# Altium project Daughter_Board_IF_RX.PrjPcb (part 2 of 2)

## Sheet Power.SchDoc: {Наименование}
size 420 x 297 mm; ApprovedBy: {Утвердил}; CheckedBy: {Проверил}; DrawnBy: {Разраб.}; DocumentNumber: НРДЦ.ХХХХХХ.ХХХ 00; SheetNumber: {}; SheetTotal: {}; Scale: {Мш.}; PageSetup: Record=PageOptions|CenterHorizontal=False|CenterVertical=False|PrintScale=0.95|XCorrection=0.00|YCorrection=0.00|PrintKind=1|BorderSize=5000000|LeftOffset=0|BottomOffset=0|Orientation=1|PaperLength=1000|PaperWidth=1000|Scale=100|PaperSource=15|PrintQuality=600|MediaType=1|DitherType=10|PaperKind=A4|PrintScaleMode=1; ProcessInspection: {Т.контр.}; Mass: {М.}; NormInspection: {Н.контр.}; Letter1Column: {}; Letter2Column: {}; Letter3Column: {}; DocumentType: {Документ}; Rule: PcbType=ProtelPcb
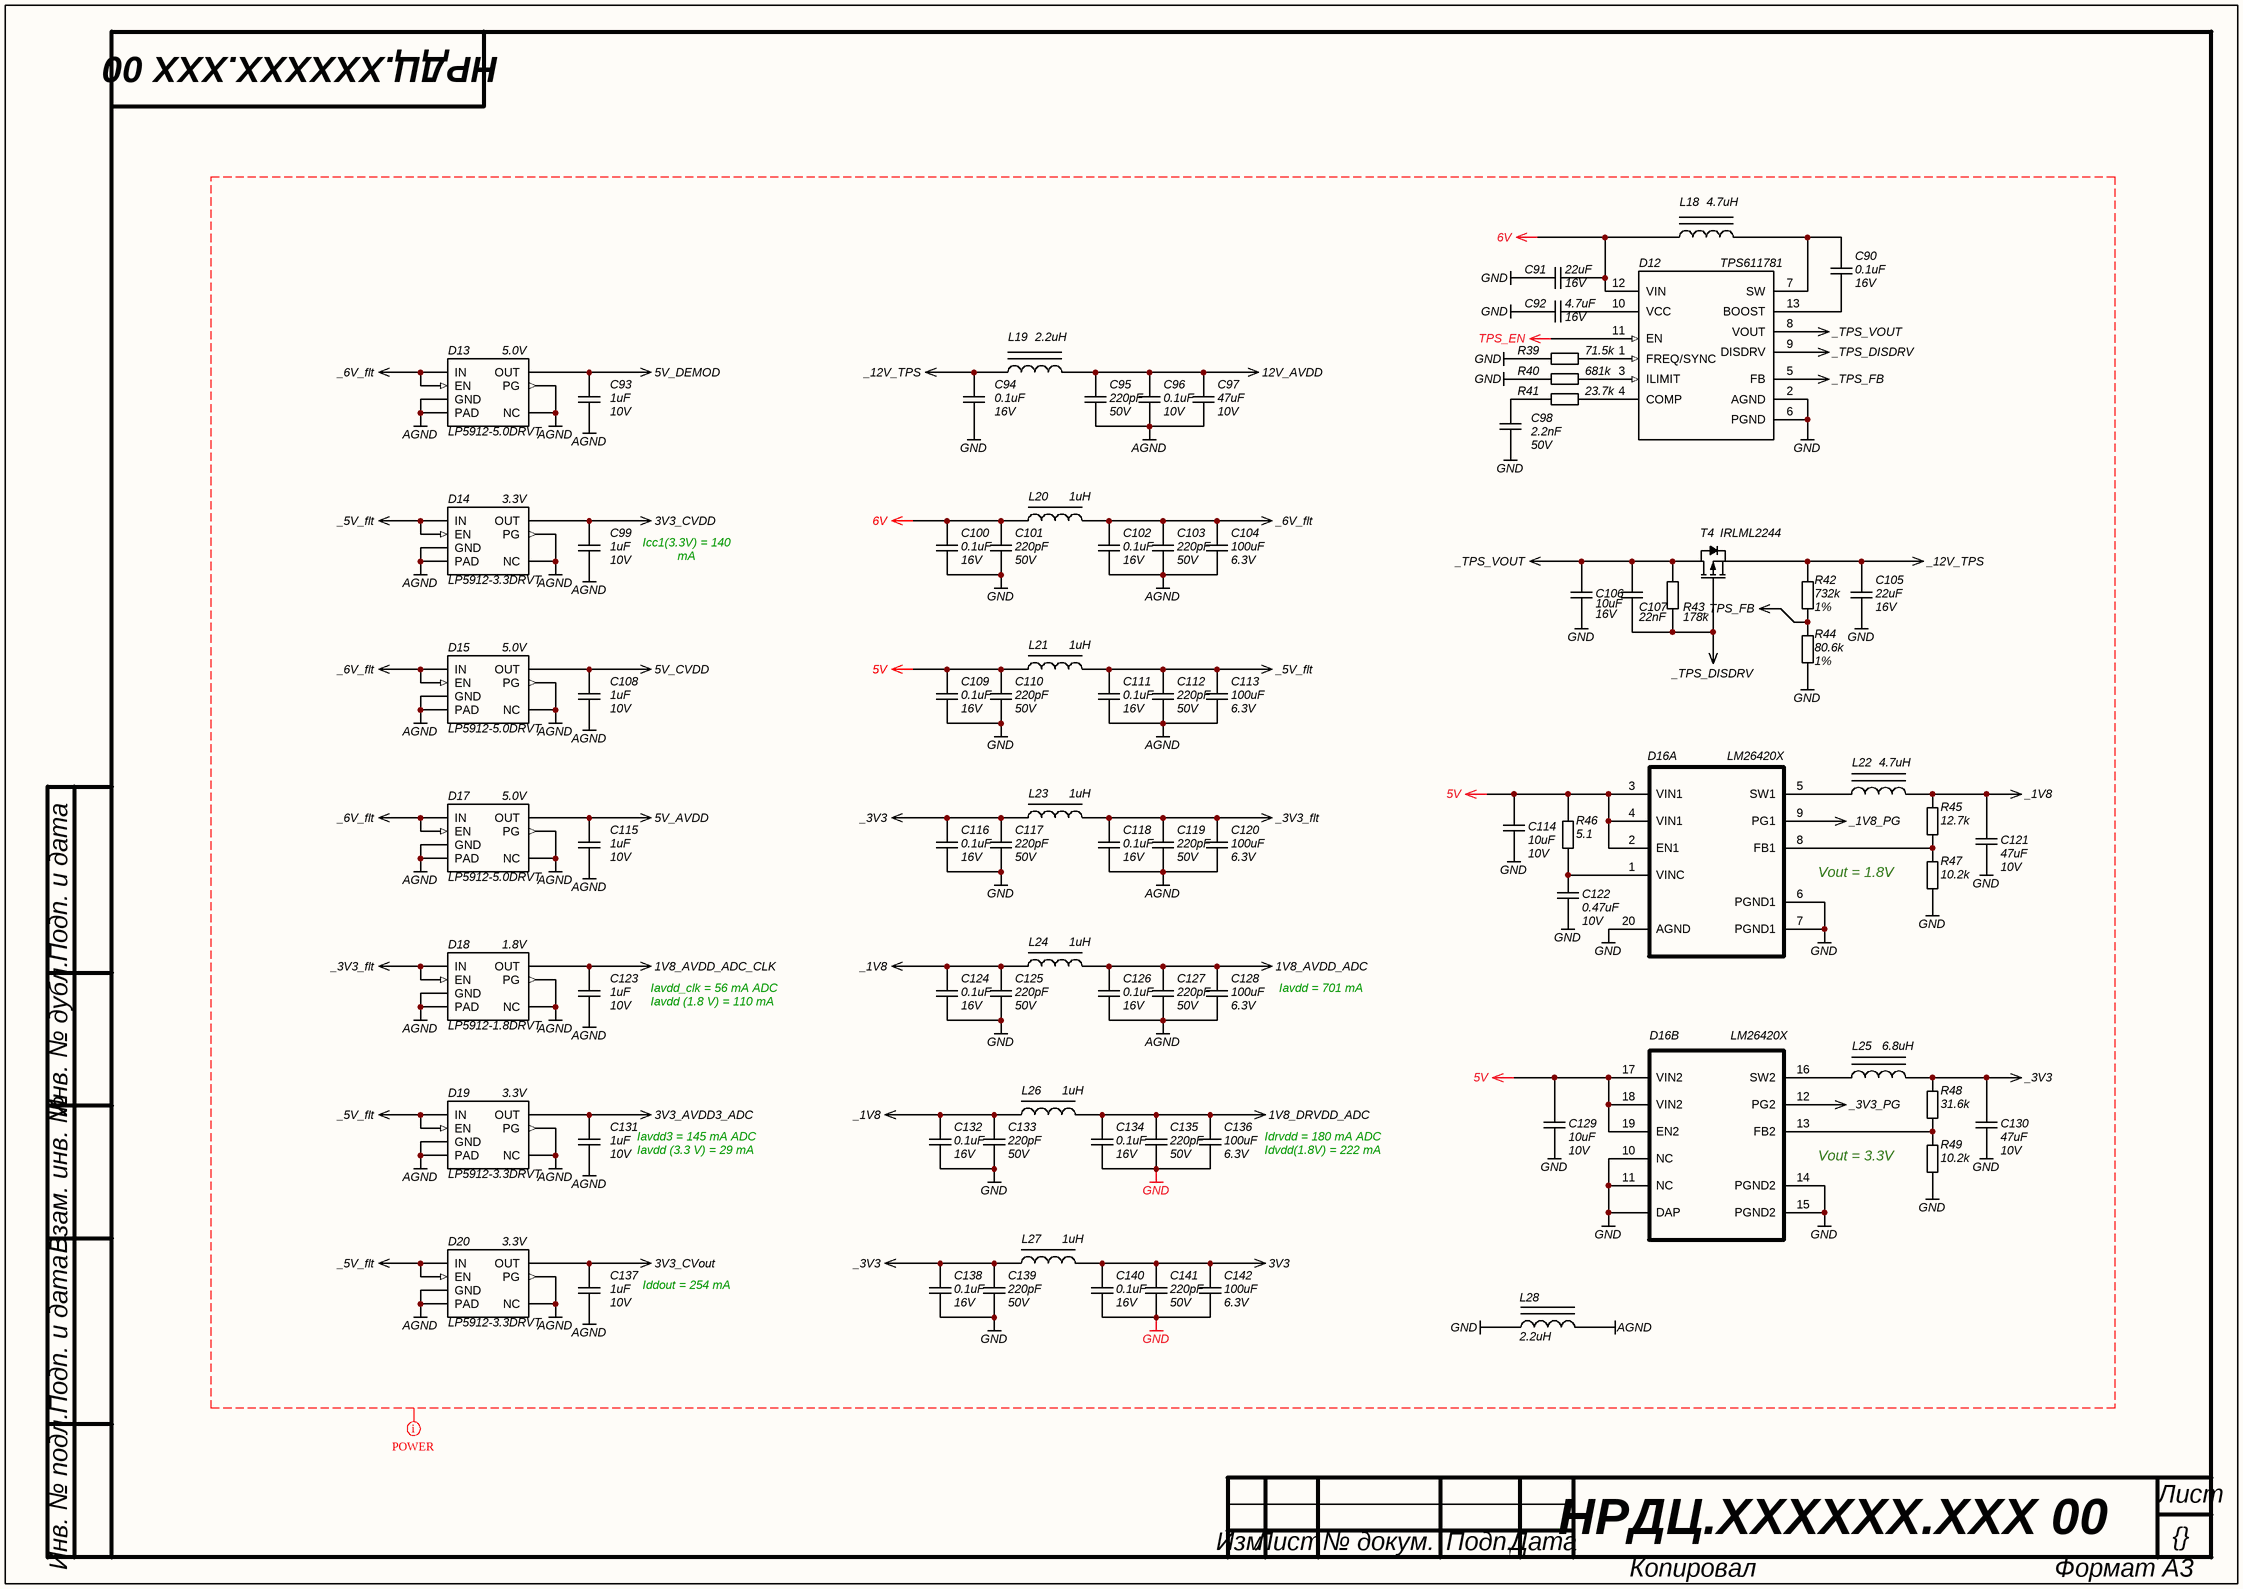
[diagram p4: Power.SchDoc]

### Parts
C90  value 0.1uF  Voltage: 16V  [C0402]  (hidden comment: CAP)
C91  value 22uF  Voltage: 16V  [C0805]  (hidden comment: CAP uF)
C92  value 4.7uF  Voltage: 16V  [C0603]  (hidden comment: CAP)
C93  value 1uF  Voltage: 10V  [C0805]  (hidden comment: CAP)
C94  value 0.1uF  Voltage: 16V  [C0402]  (hidden comment: CAP)
C95  value 220pF  Voltage: 50V  [C0603]  (hidden comment: CAP)
C96  value 0.1uF  Voltage: 10V  [C0402]  (hidden comment: CAP)
C97  value 47uF  Voltage: 10V  [C1210]  (hidden comment: CAP uF)
C98  value 2.2nF  Voltage: 50V  [C0603]  (hidden comment: CAP)
C99  value 1uF  Voltage: 10V  [C0805]  (hidden comment: CAP)
C100  value 0.1uF  Voltage: 16V  [C0603]  (hidden comment: CAP)
C101  value 220pF  Voltage: 50V  [C0603]  (hidden comment: CAP)
C102  value 0.1uF  Voltage: 16V  [C0603]  (hidden comment: CAP)
C103  value 220pF  Voltage: 50V  [C0603]  (hidden comment: CAP)
C104  value 100uF  Voltage: 6.3V  [C1210]  (hidden comment: CAP uF)
C105  value 22uF  Voltage: 16V  [C0805]  (hidden comment: CAP uF)
C106  value 10uF  Voltage: 16V  [C0805]  (hidden comment: CAP uF)
C107  value 22nF  [C0402]  (hidden comment: CAP)
C108  value 1uF  Voltage: 10V  [C0805]  (hidden comment: CAP)
C109  value 0.1uF  Voltage: 16V  [C0603]  (hidden comment: CAP)
C110  value 220pF  Voltage: 50V  [C0603]  (hidden comment: CAP)
C111  value 0.1uF  Voltage: 16V  [C0603]  (hidden comment: CAP)
C112  value 220pF  Voltage: 50V  [C0603]  (hidden comment: CAP)
C113  value 100uF  Voltage: 6.3V  [C1210]  (hidden comment: CAP uF)
C114  value 10uF  Voltage: 10V  [C0805]  (hidden comment: CAP uF)
C115  value 1uF  Voltage: 10V  [C0805]  (hidden comment: CAP)
C116  value 0.1uF  Voltage: 16V  [C0603]  (hidden comment: CAP)
C117  value 220pF  Voltage: 50V  [C0603]  (hidden comment: CAP)
C118  value 0.1uF  Voltage: 16V  [C0603]  (hidden comment: CAP)
C119  value 220pF  Voltage: 50V  [C0603]  (hidden comment: CAP)
C120  value 100uF  Voltage: 6.3V  [C1210]  (hidden comment: CAP uF)
C121  value 47uF  Voltage: 10V  [C1210]  (hidden comment: CAP uF)
C122  value 0.47uF  Voltage: 10V  [C0603]  (hidden comment: CAP)
C123  value 1uF  Voltage: 10V  [C0805]  (hidden comment: CAP)
C124  value 0.1uF  Voltage: 16V  [C0603]  (hidden comment: CAP)
C125  value 220pF  Voltage: 50V  [C0603]  (hidden comment: CAP)
C126  value 0.1uF  Voltage: 16V  [C0603]  (hidden comment: CAP)
C127  value 220pF  Voltage: 50V  [C0603]  (hidden comment: CAP)
C128  value 100uF  Voltage: 6.3V  [C1210]  (hidden comment: CAP uF)
C129  value 10uF  Voltage: 10V  [C0805]  (hidden comment: CAP uF)
C130  value 47uF  Voltage: 10V  [C1210]  (hidden comment: CAP uF)
C131  value 1uF  Voltage: 10V  [C0805]  (hidden comment: CAP)
C132  value 0.1uF  Voltage: 16V  [C0603]  (hidden comment: CAP)
C133  value 220pF  Voltage: 50V  [C0603]  (hidden comment: CAP)
C134  value 0.1uF  Voltage: 16V  [C0603]  (hidden comment: CAP)
C135  value 220pF  Voltage: 50V  [C0603]  (hidden comment: CAP)
C136  value 100uF  Voltage: 6.3V  [C1210]  (hidden comment: CAP uF)
C137  value 1uF  Voltage: 10V  [C0805]  (hidden comment: CAP)
C138  value 0.1uF  Voltage: 16V  [C0603]  (hidden comment: CAP)
C139  value 220pF  Voltage: 50V  [C0603]  (hidden comment: CAP)
C140  value 0.1uF  Voltage: 16V  [C0603]  (hidden comment: CAP)
C141  value 220pF  Voltage: 50V  [C0603]  (hidden comment: CAP)
C142  value 100uF  Voltage: 6.3V  [C1210]  (hidden comment: CAP uF)
D12  TPS611781  [TPS611781x]
D13  Name: LP5912-5.0DRVT  Voltage: 5.0V  [WSON-6]  (hidden comment: LP5912)
D14  Name: LP5912-3.3DRVT  Voltage: 3.3V  [WSON-6]  (hidden comment: LP5912)
D15  Name: LP5912-5.0DRVT  Voltage: 5.0V  [WSON-6]  (hidden comment: LP5912)
D16  LM26420X  [HTSSOP-20]  (parts A,B of 2)
D17  Name: LP5912-5.0DRVT  Voltage: 5.0V  [WSON-6]  (hidden comment: LP5912)
D18  Name: LP5912-1.8DRVT  Voltage: 1.8V  [WSON-6]  (hidden comment: LP5912)
D19  Name: LP5912-3.3DRVT  Voltage: 3.3V  [WSON-6]  (hidden comment: LP5912)
D20  Name: LP5912-3.3DRVT  Voltage: 3.3V  [WSON-6]  (hidden comment: LP5912)
L18  value 4.7uH  [XAL4030]  (hidden comment: Inductor PWR)
L19  value 2.2uH  [XAL4030]  (hidden comment: Inductor PWR)
L20  value 1uH  [L1210_Murata LQH]  (hidden comment: Inductor LF)
L21  value 1uH  [L1210_Murata LQH]  (hidden comment: Inductor LF)
L22  value 4.7uH  [XAL4030]  (hidden comment: Inductor PWR)
L23  value 1uH  [L1210_Murata LQH]  (hidden comment: Inductor LF)
L24  value 1uH  [L1210_Murata LQH]  (hidden comment: Inductor LF)
L25  value 6.8uH  [XAL4030]  (hidden comment: Inductor PWR)
L26  value 1uH  [L1210_Murata LQH]  (hidden comment: Inductor LF)
L27  value 1uH  [L1210_Murata LQH]  (hidden comment: Inductor LF)
L28  value 2.2uH  [XAL4030]  (hidden comment: Inductor PWR)
R39  value 71.5k  [R0402]  (hidden comment: RES)
R40  value 681k  [R0402]  (hidden comment: RES)
R41  value 23.7k  [R0603]  (hidden comment: RES)
R42  value 732k  Tolerance: 1%  [R0402]  (hidden comment: RES)
R43  value 178k  [R0402]  (hidden comment: RES)
R44  value 80.6k  Tolerance: 1%  [R0402]  (hidden comment: RES)
R45  value 12.7k  [R0402]  (hidden comment: RES)
R46  value 5.1  [R0402]  (hidden comment: RES)
R47  value 10.2k  [R0402]  (hidden comment: RES)
R48  value 31.6k  [R0402]  (hidden comment: RES)
R49  value 10.2k  [R0402]  (hidden comment: RES)
T4  IRLML2244  [SOT-23]

### Nets
1V8_AVDD_ADC: C126.2 C127.2 C128.2 L24.2
1V8_AVDD_ADC_CLK: C123.1 D18.1(OUT)
1V8_DRVDD_ADC: C134.2 C135.2 C136.2 L26.2
3V3: C140.2 C141.2 C142.2 L27.2
3V3_AVDD3_ADC: C131.1 D19.1(OUT)
3V3_CVDD: C99.1 D14.1(OUT)
3V3_CVout: C137.1 D20.1(OUT)
5V: C109.2 C110.2 C114.2 C129.2 D16.2(EN1) D16.3(VIN1) D16.4(VIN1) D16.17(VIN2) D16.18(VIN2) D16.19(EN2) L21.1 R46.2
5V_AVDD: C115.1 D17.1(OUT)
5V_CVDD: C108.1 D15.1(OUT)
5V_DEMOD: C93.1 D13.1(OUT)
6V: C91.1 C100.2 C101.2 D12.12(VIN) L18.1 L20.1
12V_AVDD: C95.2 C96.2 C97.2 L19.2
_1V8: C121.2 C124.2 C125.2 C132.2 C133.2 L22.2 L24.1 L26.1 R45.2
_1V8_PG: D16.9(PG1)
_3V3: C116.2 C117.2 C130.2 C138.2 C139.2 L23.1 L25.2 L27.1 R48.2
_3V3_flt: C118.2 C119.2 C120.2 D18.4(EN) D18.6(IN) L23.2
_3V3_PG: D16.12(PG2)
_5V_flt: C111.2 C112.2 C113.2 D14.4(EN) D14.6(IN) D19.4(EN) D19.6(IN) D20.4(EN) D20.6(IN) L21.2
_6V_flt: C102.2 C103.2 C104.2 D13.4(EN) D13.6(IN) D15.4(EN) D15.6(IN) D17.4(EN) D17.6(IN) L20.2
_12V_TPS: C94.2 C105.2 L19.1 R42.2 T4.2(S)
_TPS_DISDRV: C107.2 D12.9(DISDRV) R43.1 T4.1(G)
_TPS_FB: D12.5(FB) R42.1 R44.2
_TPS_VOUT: C106.2 C107.1 D12.8(VOUT) R43.2 T4.3(D)
AGND: C93.2 C95.1 C96.1 C97.1 C99.2 C102.1 C103.1 C104.1 C108.2 C111.1 C112.1 C113.1 C115.2 C118.1 C119.1 C120.1 C123.2 C126.1 C127.1 C128.1 C131.2 C137.2 D13.0(PAD) D13.2(NC) D13.3(PG) D13.5(GND) D14.0(PAD) D14.2(NC) D14.3(PG) D14.5(GND) D15.0(PAD) D15.2(NC) D15.3(PG) D15.5(GND) D17.0(PAD) D17.2(NC) D17.3(PG) D17.5(GND) D18.0(PAD) D18.2(NC) D18.3(PG) D18.5(GND) D19.0(PAD) D19.2(NC) D19.3(PG) D19.5(GND) D20.0(PAD) D20.2(NC) D20.3(PG) D20.5(GND) L28.2
GND: C91.2 C92.2 C94.1 C98.1 C100.1 C101.1 C105.1 C106.1 C109.1 C110.1 C114.1 C116.1 C117.1 C121.1 C122.1 C124.1 C125.1 C129.1 C130.1 C132.1 C133.1 C134.1 C135.1 C136.1 C138.1 C139.1 C140.1 C141.1 C142.1 D12.2(AGND) D12.6(PGND) D16.6(PGND1) D16.7(PGND1) D16.10(NC) D16.11(NC) D16.14(PGND2) D16.15(PGND2) D16.20(AGND) D16.21(DAP) L28.1 R39.1 R40.1 R44.1 R47.1 R49.1
TPS_EN: D12.11(EN)
NetC90_1: C90.1 D12.13(BOOST)
NetC90_2: C90.2 D12.7(SW) L18.2
NetC92_1: C92.1 D12.10(VCC)
NetC98_2: C98.2 R41.1
NetC122_2: C122.2 D16.1(VINC) R46.1
NetD12_1: D12.1(FREQ/SYNC) R39.2
NetD12_3: D12.3(ILIMIT) R40.2
NetD12_4: D12.4(COMP) R41.2
NetD16_5: D16.5(SW1) L22.1
NetD16_8: D16.8(FB1) R45.1 R47.2
NetD16_13: D16.13(FB2) R48.1 R49.2
NetD16_16: D16.16(SW2) L25.1

### Layout directives
net class POWER: 1V8_AVDD_ADC, 1V8_AVDD_ADC_CLK, 1V8_DRVDD_ADC, 3V3, 3V3_AVDD3_ADC, 3V3_CVDD, 3V3_CVout, 5V, 5V_AVDD, 5V_CVDD, 5V_DEMOD, 6V, 12V_AVDD, _1V8, _1V8_PG, _3V3, _3V3_flt, _3V3_PG, _5V_flt, _6V_flt, _12V_TPS, _TPS_DISDRV, _TPS_FB, _TPS_VOUT, AGND, GND, TPS_EN

### Notes on the sheet
- (near C99) Icc1(3.3V) = 140 mA
  Icc2(3.3V) = 130 mA
- Vout = 1.8V
- Iavdd = 701 mA ADC
- Iavdd_clk = 56 mA ADC
  Iavdd (1.8 V) = 110 mA DDS
- (near C131) Iavdd3 = 145 mA ADC
  Iavdd (3.3 V) = 29 mA DDS
- Idrvdd = 180 mA ADC
  Idvdd(1.8V) = 222 mA DDS
- Vout = 3.3V
- (near C137) Iddout = 254 mA
- Подп. и дата
- Инв. № дубл.
- Взам. инв. №
- Инв. № подл.
- Лист
- Изм.
- № докум.
- Подп.
- Дата
- Копировал
- Формат А3

### Library data of the parts
C90 C94 = CAP: SMD Capacitor; Manufacturer: Murata; Material: X5R; Tolerance: ±10%; Type: Ceramic Capacitor; P/N: GRM155R61C104KA88D
C91 C105 = CAP uF: SMD Capacitor; Manufacturer: Murata; Material: X5R; Tolerance: ±20%; Type: Ceramic Capacitor; P/N: GRM21BR61C226ME44L
C92 = CAP: SMD Capacitor; Manufacturer: Murata; Material: X5R; Tolerance: 10%; Type: Ceramic Capacitor; P/N: GRM188R61C475KAAJD
C93 C99 C108 C115 C123 C131 C137 = CAP: SMD Capacitor; Manufacturer: Murata; Material: X7R; Tolerance: 10%; Type: Ceramic Capacitor; P/N: GRM21BR71A105KA01K
C95 C101 C103 C110 C112 C117 C119 C125 C127 C133 C135 C139 C141 = CAP: SMD Capacitor; Manufacturer: Murata; Material: X7R; Tolerance: 10%; Type: Ceramic Capacitor; P/N: GRM188R71H221KA01D
C96 = CAP: SMD Capacitor; Manufacturer: Murata; Material: X7R; Tolerance: 10%; Type: Ceramic Capacitor; P/N: GRM155R71A104KA01J
C97 C121 C130 = CAP uF: SMD Capacitor; Manufacturer: Murata; Material: X7R; Tolerance: 10%; Type: Ceramic Capacitor; P/N: GRM32ER71A476KE15L
C98 = CAP: SMD Capacitor; Manufacturer: Murata; Material: NP0; Tolerance: ±5%; Type: Ceramic Capacitor; P/N: GRM1885C1H222JA01D
C100 C102 C109 C111 C116 C118 C124 C126 C132 C134 C138 C140 = CAP: SMD Capacitor; Manufacturer: Murata; Material: X7R; Tolerance: 10%; Type: Ceramic Capacitor; P/N: GRM188R71C104KA01D
C104 C113 C120 C128 C136 C142 = CAP uF: SMD Capacitor; Manufacturer: Murata; Material: X5R; Tolerance: 20%; Type: Ceramic Capacitor; P/N: GRM32ER60J107ME20L
C106 = CAP uF: SMD Capacitor; Manufacturer: Murata; Material: X5R; Tolerance: ±10%; Type: Ceramic Capacitor; P/N: GRM21BR61C106KE15K
C107 = CAP: SMD Capacitor; Manufacturer: Murata; Material: X7R; Tolerance: 10%; Voltage: 50V; Type: Ceramic Capacitor; P/N: GCM155R71H223KA55D
C114 C129 = CAP uF: SMD Capacitor; Manufacturer: Murata; Material: X5R; Tolerance: 10%; Type: Ceramic Capacitor; P/N: GRM21BR71A106KE51L
C122 = CAP: SMD Capacitor; Manufacturer: Murata; Material: X7R; Tolerance: 10%; Type: Ceramic Capacitor; P/N: GRM188R71A474KA61D
D12 = TPS611781: 10-A Fully-Integrated Synchronous Boost with Load Disconnect Control; Manufacturer: Texas Instruments; Voltage: 4.5 V to 20 V; P/N: TPS611781RNW; Current: 10 A; Name: TPS611781; Package: 13-VQFN-HR (3.5x3.0); Temperature Range: –40°C to 125°C; Type: Synchronous Boost; Supplier 1: Digi-Key; Supplier Part Number 1: 296-46568-1-ND
D13-D15 D17-D20 = LP5912: LP5912 500-mA Low-Noise, Low-IQ LDO; Manufacturer: Texas Instruments; Type: Low-Noise LDO; Current: 500mA; Package: WSON; Temperature Range: –40°C to 125°C
  D13 D15 D17: P/N: LP5912-5.0DRVT; Supplier 1: Arrow Electronics; Supplier Part Number 1: LP5912-5.0DRVT
  D14 D19 D20: P/N: LP5912-3.3DRVT; Supplier 1: Digi-Key; Supplier Part Number 1: 296-44153-2-ND
  D18: P/N: LP5912-1.8DRVT; Supplier 1: Digi-Key; Supplier Part Number 1: 296-44156-6-ND
D16 = LM26420X: Synchronous  DC-DC Converter; Current: 2A; Frequency: 2.2MHz; Input Voltage: 3 V to 5.5 V; Name: LM26420X; Package: HTSSOP 20; Temperature Range: −40°C to + 150°C; Type: Synchronous DC-DC Converter
L18 L22 = Inductor PWR: Magnetic-Core Inductor; Manufacturer: Coilcraft; Name: XEL4030-472ME; Current: 5A; Tolerance: ±20%; P/N: XEL4030-472MEC; Temperature Range: -40ºC to 125ºC
L19 L28 = Inductor PWR: Magnetic-Core Inductor; Manufacturer: Coilcraft; Name: XEL4030-222ME; Current: 5.9A; Tolerance: ±30%; P/N: XEL4030-222MEC; Temperature Range: -40ºC to 125ºC
L20 L21 L23 L24 L26 L27 = Inductor LF: Inductor Power Lines; Manufacturer: Murata; Name: LQH32PN1R0NNC; Current: 2500mA; Tolerance: 5%; Frequency: 100MHz; Temperature Range: -25ºC to 85ºC; Series: LQH; P/N: LQH32PN1R0NNC
L25 = Inductor PWR: Magnetic-Core Inductor; Manufacturer: Coilcraft; Name: XEL4030-682ME; Current: 5A; Tolerance: ±20%; P/N: XEL4030-682MEC; Temperature Range: -40ºC to 125ºC
R39 = RES: SMD Resistor; Manufacturer: Panasonic Electronic Components; Name: Chip SMD Resistor; Power: 0.063 Wt; Tolerance: 1%; P/N: ERJ-2RKF7152X; Temperature Range: -55…155°C
R40 = RES: SMD Resistor; Manufacturer: Panasonic Electronic Components; Name: Chip SMD Resistor; Power: 0.063 Wt; Tolerance: 1%; P/N: ERJ-2RKF6813X; Temperature Range: -55…155°C
R41 = RES: SMD Resistor; Manufacturer: Panasonic Electronic Components; Name: Chip SMD Resistor; Power: 0.1 Wt; Tolerance: 1%; P/N: ERJ-3EKF2372V; Temperature Range: -55…155°C
R42 = RES: SMD Resistor; Manufacturer: Panasonic Electronic Components; Name: Chip SMD Resistor; Power: 0.063 Wt; P/N: ERJ-2RKF7323X; Temperature Range: -55…155°C
R43 = RES: SMD Resistor; Manufacturer: Panasonic Electronic Components; Name: Chip SMD Resistor; Power: 0.063 Wt; Tolerance: 1%; P/N: ERJ-2RKF1783X; Temperature Range: -55…155°C
R44 = RES: SMD Resistor; Manufacturer: Panasonic Electronic Components; Name: Chip SMD Resistor; Power: 0.063 Wt; P/N: ERJ-2RKF8062X; Temperature Range: -55…155°C
R45 = RES: SMD Resistor; Manufacturer: Panasonic Electronic Components; Name: Chip SMD Resistor; Power: 0.062 Wt; Tolerance: 1%; P/N: ERJ-2RKF1272X; Temperature Range: -55…155°C
R46 = RES: SMD Resistor; Manufacturer: Panasonic Electronic Components; Name: Chip SMD Resistor; Power: 0.062 Wt; Tolerance: 5%; P/N: ERJ-2GEJ5R1X; Temperature Range: -55…155°C
R47 R49 = RES: SMD Resistor; Manufacturer: Panasonic Electronic Components; Name: Chip SMD Resistor; Power: 0.062 Wt; Tolerance: 1%; P/N: ERJ-2RKF1022X; Temperature Range: -55…155°C
R48 = RES: SMD Resistor; Manufacturer: Panasonic Electronic Components; Name: Chip SMD Resistor; Power: 0.062 Wt; Tolerance: 1%; P/N: ERJ-2RKF3162X; Temperature Range: -55…155°C
T4 = IRLML2244: P-Channel MOSFET; Current: 4.3A; Channel Resistance: 54 mΩ; Power Dissipation: 1.3W; Voltage: -20V; Name: IRLML2244; Package: SOT-23; Type: P-Channel Mosfet

## Sheet DBoard_Conn.SchDoc: {Наименование}
size 420 x 297 mm; DocumentNumber: НРДЦ.ХХХХХХ.ХХХ ХХ; SheetNumber: {}; SheetTotal: {}; PageSetup: Record=PageOptions|CenterHorizontal=False|CenterVertical=False|PrintScale=0.95|XCorrection=0.00|YCorrection=0.00|PrintKind=1|BorderSize=5000000|LeftOffset=0|BottomOffset=0|Orientation=1|PaperLength=1000|PaperWidth=1000|Scale=100|PaperSource=15|PrintQuality=600|MediaType=1|DitherType=10|PaperKind=A4|PrintScaleMode=1; Rule: PcbType=ProtelPcb
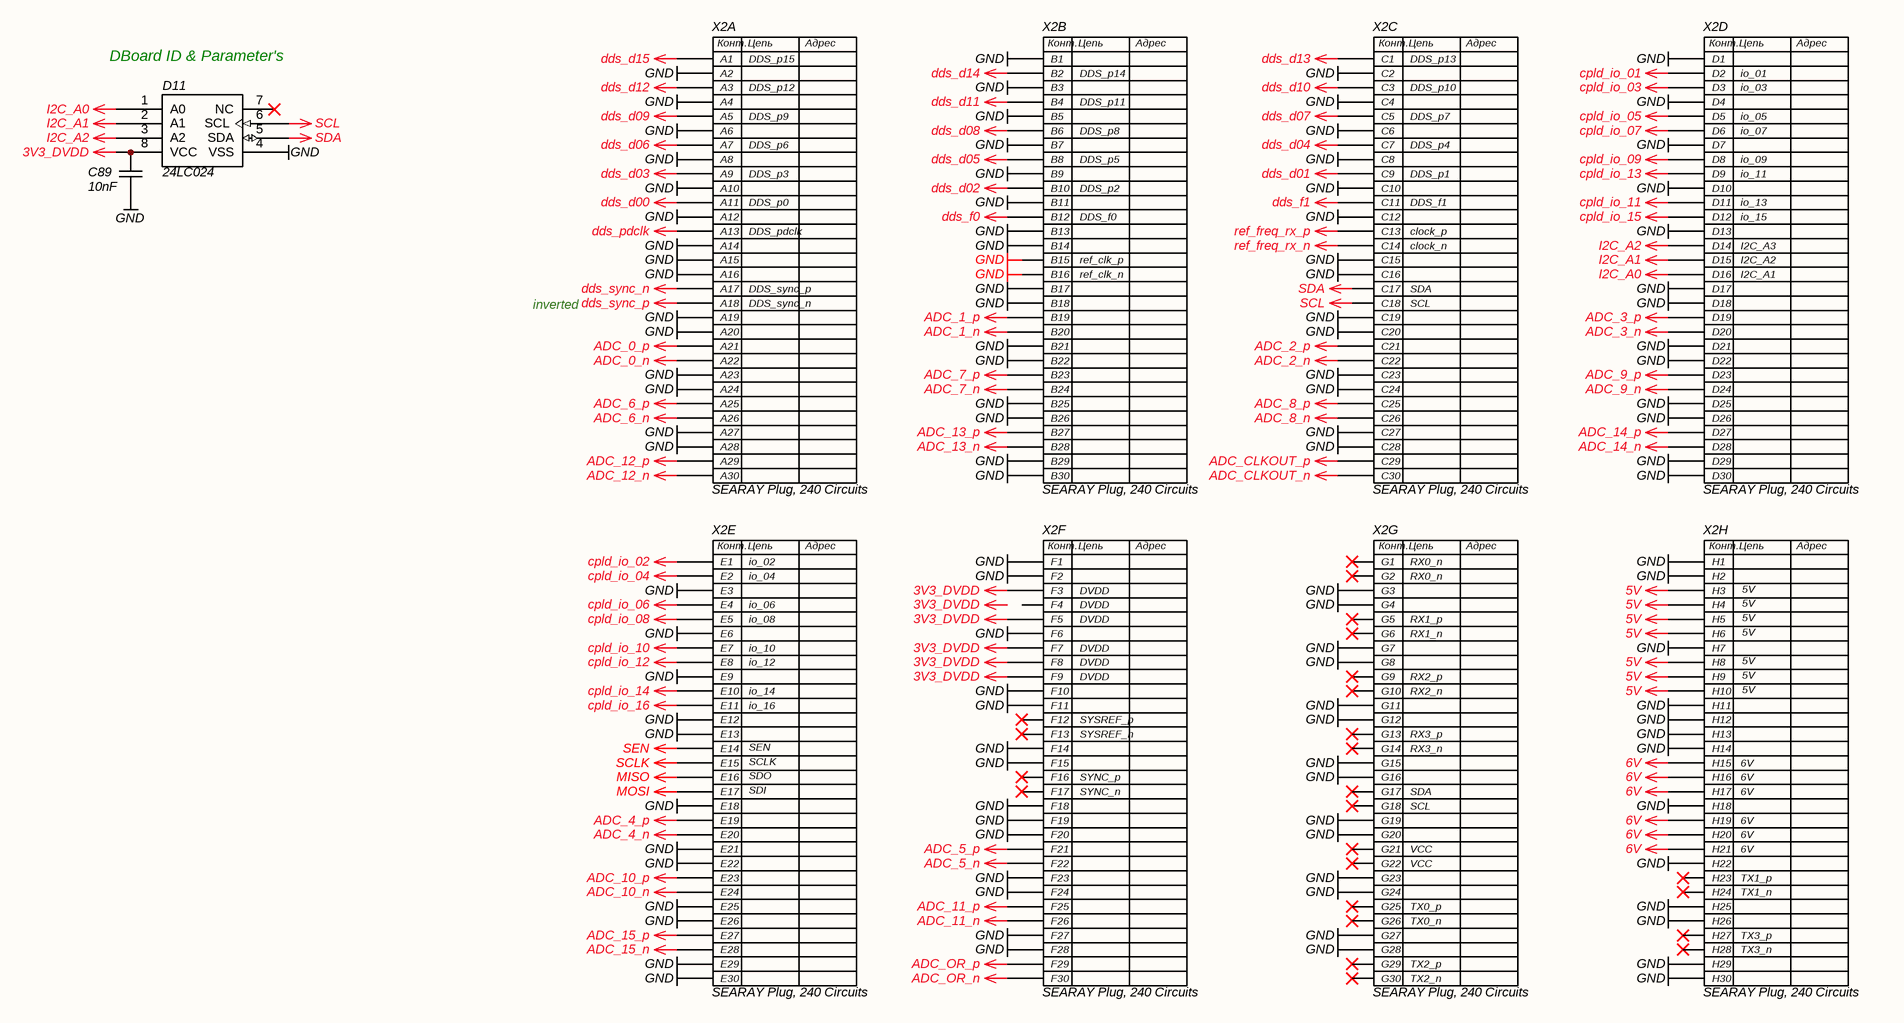
[diagram p5: DBoard_Conn.SchDoc]

### Parts
C89  value 10nF  [C0402]  (hidden comment: CAP)
D11  24LC024  [SOIC_SN8]
X2  SEARAY Plug, 240 Circuits  [Molex_459703185]  (parts A,B,C,D,E,F,G,H of 8)

### Nets
3V3_DVDD: C89.2 D11.8(VCC) X2.F3 X2.F5 X2.F7 X2.F8 X2.F9
5V: X2.H3 X2.H4 X2.H5 X2.H6 X2.H8 X2.H9 X2.H10
6V: X2.H15 X2.H16 X2.H17 X2.H19 X2.H20 X2.H21
ADC_0_n: X2.A22
ADC_0_p: X2.A21
ADC_1_n: X2.B20
ADC_1_p: X2.B19
ADC_2_n: X2.C22
ADC_2_p: X2.C21
ADC_3_n: X2.D20
ADC_3_p: X2.D19
ADC_4_n: X2.E20
ADC_4_p: X2.E19
ADC_5_n: X2.F22
ADC_5_p: X2.F21
ADC_6_n: X2.A26
ADC_6_p: X2.A25
ADC_7_n: X2.B24
ADC_7_p: X2.B23
ADC_8_n: X2.C26
ADC_8_p: X2.C25
ADC_9_n: X2.D24
ADC_9_p: X2.D23
ADC_10_n: X2.E24
ADC_10_p: X2.E23
ADC_11_n: X2.F26
ADC_11_p: X2.F25
ADC_12_n: X2.A30
ADC_12_p: X2.A29
ADC_13_n: X2.B28
ADC_13_p: X2.B27
ADC_14_n: X2.D28
ADC_14_p: X2.D27
ADC_15_n: X2.E28
ADC_15_p: X2.E27
ADC_CLKOUT_n: X2.C30
ADC_CLKOUT_p: X2.C29
ADC_OR_n: X2.F30
ADC_OR_p: X2.F29
cpld_io_01: X2.D2
cpld_io_02: X2.E1
cpld_io_03: X2.D3
cpld_io_04: X2.E2
cpld_io_05: X2.D5
cpld_io_06: X2.E4
cpld_io_07: X2.D6
cpld_io_08: X2.E5
cpld_io_09: X2.D8
cpld_io_10: X2.E7
cpld_io_11: X2.D11
cpld_io_12: X2.E8
cpld_io_13: X2.D9
cpld_io_14: X2.E10
cpld_io_15: X2.D12
cpld_io_16: X2.E11
dds_d00: X2.A11
dds_d01: X2.C9
dds_d02: X2.B10
dds_d03: X2.A9
dds_d04: X2.C7
dds_d05: X2.B8
dds_d06: X2.A7
dds_d07: X2.C5
dds_d08: X2.B6
dds_d09: X2.A5
dds_d10: X2.C3
dds_d11: X2.B4
dds_d12: X2.A3
dds_d13: X2.C1
dds_d14: X2.B2
dds_d15: X2.A1
dds_f0: X2.B12
dds_f1: X2.C11
dds_pdclk: X2.A13
dds_sync_n: X2.A17
dds_sync_p: X2.A18
GND: C89.1 D11.4(VSS) X2.A2 X2.A4 X2.A6 X2.A8 X2.A10 X2.A12 X2.A14 X2.A15 X2.A16 X2.A19 X2.A20 X2.A23 X2.A24 X2.A27 X2.A28 X2.B1 X2.B3 X2.B5 X2.B7 X2.B9 X2.B11 X2.B13 X2.B14 X2.B15 X2.B16 X2.B17 X2.B18 X2.B21 X2.B22 X2.B25 X2.B26 X2.B29 X2.B30 X2.C2 X2.C4 X2.C6 X2.C8 X2.C10 X2.C12 X2.C15 X2.C16 X2.C19 X2.C20 X2.C23 X2.C24 X2.C27 X2.C28 X2.D1 X2.D4 X2.D7 X2.D10 X2.D13 X2.D17 X2.D18 X2.D21 X2.D22 X2.D25 X2.D26 X2.D29 X2.D30 X2.E3 X2.E6 X2.E9 X2.E12 X2.E13 X2.E18 X2.E21 X2.E22 X2.E25 X2.E26 X2.E29 X2.E30 X2.F1 X2.F2 X2.F6 X2.F10 X2.F11 X2.F14 X2.F15 X2.F18 X2.F19 X2.F20 X2.F23 X2.F24 X2.F27 X2.F28 X2.G3 X2.G4 X2.G7 X2.G8 X2.G11 X2.G12 X2.G15 X2.G16 X2.G19 X2.G20 X2.G23 X2.G24 X2.G27 X2.G28 X2.H1 X2.H2 X2.H7 X2.H11 X2.H12 X2.H13 X2.H14 X2.H18 X2.H22 X2.H25 X2.H26 X2.H29 X2.H30
I2C_A0: D11.1(A0) X2.D16
I2C_A1: D11.2(A1) X2.D15
I2C_A2: D11.3(A2) X2.D14
MISO: X2.E16
MOSI: X2.E17
ref_freq_rx_n: X2.C14
ref_freq_rx_p: X2.C13
SCL: D11.6(SCL) X2.C18
SCLK: X2.E15
SDA: D11.5(SDA) X2.C17
SEN: X2.E14

Not connected (* = marked no-connect by the designer): D11 7(NC)*; X2 F4 F12* F13* F16* F17* G1* G2* G5* G6* G9* G10* G13* G14* G17* G18* G21* G22* G25* G26* G29* G30* H23* H24* H27* H28*

### Notes on the sheet
- (near D11) DBoard ID & Parameter's
- (near X2) io_01
- (near X2) io_03
- (near X2) io_05
- (near X2) io_07
- (near X2) io_09
- (near X2) io_11
- (near X2) io_13
- (near X2) ref_clk_p
- (near X2) ref_clk_n
- (near X2) clock_n
- (near X2) clock_p
- (near X2) I2C_A2
- (near X2) I2C_A1
- (near X2) I2C_A3
- (near X2) io_15
- inverted
- (near X2) SCL
- (near X2) SDA
- (near X2) io_02
- (near X2) io_04
- (near X2) io_06
- (near X2) io_08
- (near X2) DVDD
- (near X2) 5V
- (near X2) io_10
- (near X2) io_12
- (near X2) io_14
- (near X2) io_16
- (near X2) SCLK
- (near X2) SDO
- (near X2) SEN
- (near X2) 6V
- (near X2) SDI
- Labels drawn without touching a wire or pin: 3V3_DVDD, DDS_f0, DDS_f1, DDS_p0, DDS_p1, DDS_p2, DDS_p3, DDS_p4, DDS_p5, DDS_p6, DDS_p7, DDS_p8, DDS_p9, DDS_p10, DDS_p11, DDS_p12, DDS_p13, DDS_p14, DDS_p15, DDS_pdclk, DDS_sync_n, DDS_sync_p, RX0_n, RX1_n, RX1_p, RX2_n, RX2_p, RX3_n, RX3_p, SCL, SDA, SYNC_n, SYNC_p, SYSREF_n, SYSREF_p, TX0_n, TX0_p, TX1_n, TX1_p, TX2_n, TX2_p, TX3_n, TX3_p, VCC
- Подп. и дата
- Инв. № дубл.
- Взам. инв. №
- Инв. № подл.
- Лист
- Изм.
- № докум.
- Подп.
- Дата
- Копировал
- Формат А3
- (in symbol Molex_SEARAY™ 45970, part A) Конт.; Цепь; Адрес
- (in symbol Molex_SEARAY™ 45970, part B) Конт.; Цепь; Адрес
- (in symbol Molex_SEARAY™ 45970, part C) Конт.; Цепь; Адрес
- (in symbol Molex_SEARAY™ 45970, part D) Конт.; Цепь; Адрес
- (in symbol Molex_SEARAY™ 45970, part E) Конт.; Цепь; Адрес
- (in symbol Molex_SEARAY™ 45970, part F) Конт.; Цепь; Адрес
- (in symbol Molex_SEARAY™ 45970, part G) Конт.; Цепь; Адрес
- (in symbol Molex_SEARAY™ 45970, part H) Конт.; Цепь; Адрес

### Library data of the parts
C89 = CAP: SMD Capacitor; Manufacturer: Murata; Material: X7R; Tolerance: 10%; Voltage: 25V; Type: Ceramic Capacitor; P/N: GRM155R71E103KA01D
D11 = 24LC024: I2C EEPROM; Manufacturer: Microchip; Capacity: 2kbit; Max Clock: 400 kHz; Voltage: 2.5-5.5V; Name: 24LC024; Package: SOIC-8; Type: I2C EEPROM
X2 = Molex_SEARAY™ 45970: 1.27mm Pitch, SEARAY Plug, 240 Circuits, 2.00mm Unmated Height, 8 Rows, with Pegs; Manufacturer: Molex; Name: 459703185; Pitch: 0.050" (1.27mm); Number of Positions: 240; P/N: 45970-3185; Mates With: SEARAY™ 45971 Series; IsBGA: TRUE; Mates With P/N: 45971-3185; Series: SEARAY™ 45970; Number of Rows: 8; Mounting Type: Surface Mount

## Nets that join several sheets
1V8_AVDD_ADC: ADC (25 pins), Power (C126.2 C127.2 C128.2 L24.2)
1V8_AVDD_ADC_CLK: ADC (8 pins), ADC_CLK (8 pins), Power (C123.1 D18.1)
1V8_DRVDD_ADC: ADC (11 pins), ADC_CLK (12 pins), CPLD (10 pins), Power (C134.2 C135.2 C136.2 L26.2)
3V3: ADC_CLK (17 pins), CPLD (21 pins), Power (C140.2 C141.2 C142.2 L27.2)
3V3_AVDD3_ADC: ADC (16 pins), ADC_CLK (8 pins), Power (C131.1 D19.1)
3V3_CVDD: ADC_CLK (C177.2 C190.2 D22.21 D22.35), Power (C99.1 D14.1)
3V3_CVout: ADC_CLK (10 pins), Power (C137.1 D20.1)
5V: Power (12 pins), DBoard_Conn (7 pins)
5V_AVDD: RX (C14.2 C15.2 L1.2), Power (C115.1 D17.1)
5V_CVDD: ADC_CLK (C182.1 D22.31 R59.2 R75.2), Power (C108.1 D15.1)
6V: Power (6 pins), DBoard_Conn (6 pins)
12V_AVDD: RX (7 pins), Power (C95.2 C96.2 C97.2 L19.2)
_3V3: RX (H1.2 H2.2), ADC_CLK (H4.2), Power (9 pins)
_3V3_flt: RX (13 pins), ADC_CLK (C185.1 D23.16), Power (6 pins)
_cpld_clk: ADC_CLK (R52.1 R55.2 T5.6), CPLD (D24.M2)
_DDS_SYNC_CLK: ADC_CLK (D21.55), CPLD (R83.1)
ADC_0_n: ADC (D10.J1), DBoard_Conn (X2.A22)
ADC_0_p: ADC (D10.J2), DBoard_Conn (X2.A21)
ADC_1_n: ADC (D10.K1), DBoard_Conn (X2.B20)
ADC_1_p: ADC (D10.K2), DBoard_Conn (X2.B19)
ADC_2_n: ADC (D10.M1), DBoard_Conn (X2.C22)
ADC_2_p: ADC (D10.L1), DBoard_Conn (X2.C21)
ADC_3_n: ADC (D10.M2), DBoard_Conn (X2.D20)
ADC_3_p: ADC (D10.L2), DBoard_Conn (X2.D19)
ADC_4_n: ADC (D10.M3), DBoard_Conn (X2.E20)
ADC_4_p: ADC (D10.L3), DBoard_Conn (X2.E19)
ADC_5_n: ADC (D10.M4), DBoard_Conn (X2.F22)
ADC_5_p: ADC (D10.L4), DBoard_Conn (X2.F21)
ADC_6_n: ADC (D10.M5), DBoard_Conn (X2.A26)
ADC_6_p: ADC (D10.L5), DBoard_Conn (X2.A25)
ADC_7_n: ADC (D10.M6), DBoard_Conn (X2.B24)
ADC_7_p: ADC (D10.L6), DBoard_Conn (X2.B23)
ADC_8_n: ADC (D10.M7), DBoard_Conn (X2.C26)
ADC_8_p: ADC (D10.L7), DBoard_Conn (X2.C25)
ADC_9_n: ADC (D10.M8), DBoard_Conn (X2.D24)
ADC_9_p: ADC (D10.L8), DBoard_Conn (X2.D23)
ADC_10_n: ADC (D10.M9), DBoard_Conn (X2.E24)
ADC_10_p: ADC (D10.L9), DBoard_Conn (X2.E23)
ADC_11_n: ADC (D10.M10), DBoard_Conn (X2.F26)
ADC_11_p: ADC (D10.L10), DBoard_Conn (X2.F25)
ADC_12_n: ADC (D10.M11), DBoard_Conn (X2.A30)
ADC_12_p: ADC (D10.L11), DBoard_Conn (X2.A29)
ADC_13_n: ADC (D10.M12), DBoard_Conn (X2.B28)
ADC_13_p: ADC (D10.L12), DBoard_Conn (X2.B27)
ADC_14_n: ADC (D10.K12), DBoard_Conn (X2.D28)
ADC_14_p: ADC (D10.K11), DBoard_Conn (X2.D27)
ADC_15_n: ADC (D10.J12), DBoard_Conn (X2.E28)
ADC_15_p: ADC (D10.J11), DBoard_Conn (X2.E27)
ADC_clk_n: ADC (D10.D1), ADC_CLK (C155.1)
ADC_clk_p: ADC (D10.E1), ADC_CLK (C148.1)
ADC_CLKOUT_n: ADC (D10.K8), DBoard_Conn (X2.C30)
ADC_CLKOUT_p: ADC (D10.J8), DBoard_Conn (X2.C29)
ADC_CSB: ADC (D10.D12 R33.1), CPLD (R77.5)
ADC_OR_n: ADC (D10.H12), DBoard_Conn (X2.F30)
ADC_OR_p: ADC (D10.G12), DBoard_Conn (X2.F29)
ADC_PWDN: ADC (D10.H1 R34.1), CPLD (D24.A3)
ADC_SCLK: ADC (D10.F12), CPLD (R77.7)
ADC_SDIO: ADC (D10.E12), CPLD (R77.6)
ADC_SYNC: ADC (D10.G1), CPLD (D24.A4)
AGND: RX (56 pins), ADC (63 pins), ADC_CLK (68 pins), Power (51 pins)
ATT1_RX_C1: RX (D4.11), CPLD (D24.L12)
ATT1_RX_C2: RX (D4.10), CPLD (D24.K16)
ATT2_MOSI_RX: RX (D6.18), CPLD (R91.1)
ATT2_RX_LE: RX (D6.16), CPLD (R91.3)
ATT2_SCLK_RX: RX (D6.17), CPLD (R91.2)
cpld_io_01: CPLD (R82.5), DBoard_Conn (X2.D2)
cpld_io_02: CPLD (R82.6), DBoard_Conn (X2.E1)
cpld_io_03: CPLD (R82.7), DBoard_Conn (X2.D3)
cpld_io_04: CPLD (R82.8), DBoard_Conn (X2.E2)
cpld_io_05: CPLD (R84.5), DBoard_Conn (X2.D5)
cpld_io_06: CPLD (R84.6), DBoard_Conn (X2.E4)
cpld_io_07: CPLD (R84.7), DBoard_Conn (X2.D6)
cpld_io_08: CPLD (R84.8), DBoard_Conn (X2.E5)
cpld_io_09: CPLD (R87.5), DBoard_Conn (X2.D8)
cpld_io_10: CPLD (R87.6), DBoard_Conn (X2.E7)
cpld_io_11: CPLD (R87.7), DBoard_Conn (X2.D11)
cpld_io_12: CPLD (R87.8), DBoard_Conn (X2.E8)
cpld_io_13: CPLD (R89.5), DBoard_Conn (X2.D9)
cpld_io_14: CPLD (R89.6), DBoard_Conn (X2.E10)
cpld_io_15: CPLD (R89.7), DBoard_Conn (X2.D12)
cpld_io_16: CPLD (R89.8), DBoard_Conn (X2.E11)
CS_LTC6951: ADC_CLK (D22.17), CPLD (R78.4)
dds_cs: ADC_CLK (D21.70), CPLD (R90.5)
dds_d00: ADC_CLK (R50.4), DBoard_Conn (X2.A11)
dds_d01: ADC_CLK (R50.3), DBoard_Conn (X2.C9)
dds_d02: ADC_CLK (R50.2), DBoard_Conn (X2.B10)
dds_d03: ADC_CLK (R50.1), DBoard_Conn (X2.A9)
dds_d04: ADC_CLK (R53.4), DBoard_Conn (X2.C7)
dds_d05: ADC_CLK (R53.3), DBoard_Conn (X2.B8)
dds_d06: ADC_CLK (R53.2), DBoard_Conn (X2.A7)
dds_d07: ADC_CLK (R53.1), DBoard_Conn (X2.C5)
dds_d08: ADC_CLK (R56.4), DBoard_Conn (X2.B6)
dds_d09: ADC_CLK (R56.3), DBoard_Conn (X2.A5)
dds_d10: ADC_CLK (R56.2), DBoard_Conn (X2.C3)
dds_d11: ADC_CLK (R56.1), DBoard_Conn (X2.B4)
dds_d12: ADC_CLK (R57.4), DBoard_Conn (X2.A3)
dds_d13: ADC_CLK (R57.3), DBoard_Conn (X2.C1)
dds_d14: ADC_CLK (R57.2), DBoard_Conn (X2.B2)
dds_d15: ADC_CLK (R57.1), DBoard_Conn (X2.A1)
dds_f0: ADC_CLK (R60.3), DBoard_Conn (X2.B12)
dds_f1: ADC_CLK (R60.2), DBoard_Conn (X2.C11)
dds_io_reset: ADC_CLK (D21.71), CPLD (R92.6)
dds_io_update: ADC_CLK (D21.59), CPLD (R94.5)
dds_master_reset: ADC_CLK (D21.14), CPLD (R92.7)
dds_pdclk: ADC_CLK (D21.40), DBoard_Conn (X2.A13)
dds_profile0: ADC_CLK (D21.54), CPLD (R93.5)
dds_profile1: ADC_CLK (D21.53), CPLD (R93.6)
dds_profile2: ADC_CLK (D21.52), CPLD (R93.7)
dds_sclk: ADC_CLK (D21.69), CPLD (R90.6)
dds_sdio: ADC_CLK (D21.67), CPLD (R90.8)
dds_sdo: ADC_CLK (D21.68), CPLD (R90.7)
dds_sync_n: ADC_CLK (D21.8), DBoard_Conn (X2.A17)
dds_sync_p: ADC_CLK (D21.7), DBoard_Conn (X2.A18)
dds_sync_smp_err: ADC_CLK (D21.12), CPLD (R94.8)
dds_txenable: ADC_CLK (D21.41), CPLD (R94.7)
EXT_REF_ctrl: ADC_CLK (D23.14), CPLD (D24.M8)
GND: RX (T1.2 T2.2), ADC (12 pins), ADC_CLK (28 pins), CPLD (37 pins), Power (45 pins), DBoard_Conn (115 pins)
LED_Ext_Ref: ADC_CLK (T6.1), CPLD (D24.P8)
LED_RX: RX (T1.1), CPLD (D24.R8)
MISO: CPLD (R79.6), DBoard_Conn (X2.E16)
MISO_LTC6951: ADC_CLK (D22.20), CPLD (R78.1)
MOSI: CPLD (R79.7), DBoard_Conn (X2.E17)
MOSI_LTC6951: ADC_CLK (D22.19), CPLD (R78.2)
ram_swp_ovr: ADC_CLK (D21.24), CPLD (R94.6)
ref_freq_rx_n: ADC_CLK (C156.1), DBoard_Conn (X2.C14)
ref_freq_rx_p: ADC_CLK (C157.1), DBoard_Conn (X2.C13)
SCLK: CPLD (R79.8), DBoard_Conn (X2.E15)
SCLK_AD7922: RX (D1.3), CPLD (R86.3)
SCLK_LTC6951: ADC_CLK (D22.18), CPLD (R78.3)
SDI_AD7922: RX (D1.4), CPLD (R86.4)
SDO_AD7922: RX (D1.1), CPLD (R86.1)
SEN: CPLD (R79.5), DBoard_Conn (X2.E14)
SEN_AD7922: RX (D1.2), CPLD (R86.2)
STAT_LTC6951: ADC_CLK (D22.38), CPLD (D24.N15)
SYNC_LTC6951: ADC_CLK (D22.39 R76.2), CPLD (D24.M15)
TPS_EN: CPLD (D24.N8), Power (D12.11)